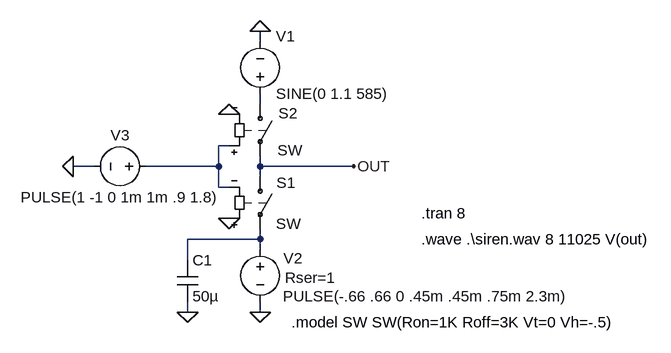
[diagram p0: schematic Siren.asc]
Siren.asc, the LTspice schematic file:
Version 4
SHEET 1 1112 680
WIRE 128 48 128 32
WIRE 128 144 128 128
WIRE 80 208 64 208
WIRE -128 240 -160 240
WIRE 64 240 64 208
WIRE 64 240 -48 240
WIRE 128 240 128 224
WIRE 272 240 128 240
WIRE 128 256 128 240
WIRE 64 272 64 240
WIRE 80 272 64 272
WIRE 128 352 128 336
WIRE 128 352 16 352
WIRE 128 368 128 352
WIRE 16 384 16 352
WIRE 16 464 16 448
WIRE 128 464 128 448
FLAG 128 32 0
FLAG 128 464 0
FLAG 80 160 0
FLAG 80 320 0
FLAG -160 240 0
FLAG 272 240 OUT
FLAG 16 464 0
SYMBOL voltage 128 352 R0
WINDOW 0 36 29 Left 0
WINDOW 3 35 88 Left 0
WINDOW 123 0 0 Left 0
WINDOW 39 38 59 Left 0
SYMATTR InstName V2
SYMATTR Value PULSE(-.66 .66 0 .45m .45m .75m 2.3m)
SYMATTR SpiceLine Rser=1
SYMBOL voltage 128 144 M180
WINDOW 0 24 104 Left 0
WINDOW 3 24 16 Left 0
WINDOW 123 0 0 Left 0
WINDOW 39 0 0 Left 0
SYMATTR InstName V1
SYMATTR Value SINE(0 1.1 585)
SYMBOL sw 128 240 R0
WINDOW 0 25 25 Left 0
WINDOW 3 24 88 Left 0
SYMATTR InstName S1
SYMBOL sw 128 128 R0
WINDOW 3 27 87 Left 0
WINDOW 0 28 30 Left 0
SYMATTR InstName S2
SYMBOL voltage -32 240 R90
WINDOW 0 -32 56 VBottom 0
WINDOW 3 32 56 VTop 0
WINDOW 123 0 0 Left 0
WINDOW 39 0 0 Left 0
SYMATTR InstName V3
SYMATTR Value PULSE(1 -1 0 1m 1m .9 1.8)
SYMBOL cap 0 448 M180
WINDOW 0 24 64 Left 0
WINDOW 3 24 8 Left 0
SYMATTR InstName C1
SYMATTR Value 50µ
TEXT 376 312 Left 0 !.tran 8
TEXT 376 352 Left 0 !.wave .\\siren.wav 8 11025 V(out)
TEXT 176 480 Left 0 !.model SW SW(Ron=1K Roff=3K Vt=0 Vh=-.5)

The netlist it stands for:
* Siren.asc
V2 N003 0 PULSE(-.66 .66 0 .45m .45m .75m 2.3m) Rser=1
V1 N001 0 SINE(0 1.1 585)
S1 OUT N003 0 N002 SW
S2 N001 OUT N002 0 SW
V3 N002 0 PULSE(1 -1 0 1m 1m .9 1.8)
C1 0 N003 50µ
.tran 8
.wave .\siren.wav 8 11025 V(out)
.model SW SW(Ron=1K Roff=3K Vt=0 Vh=-.5)
.backanno
.end